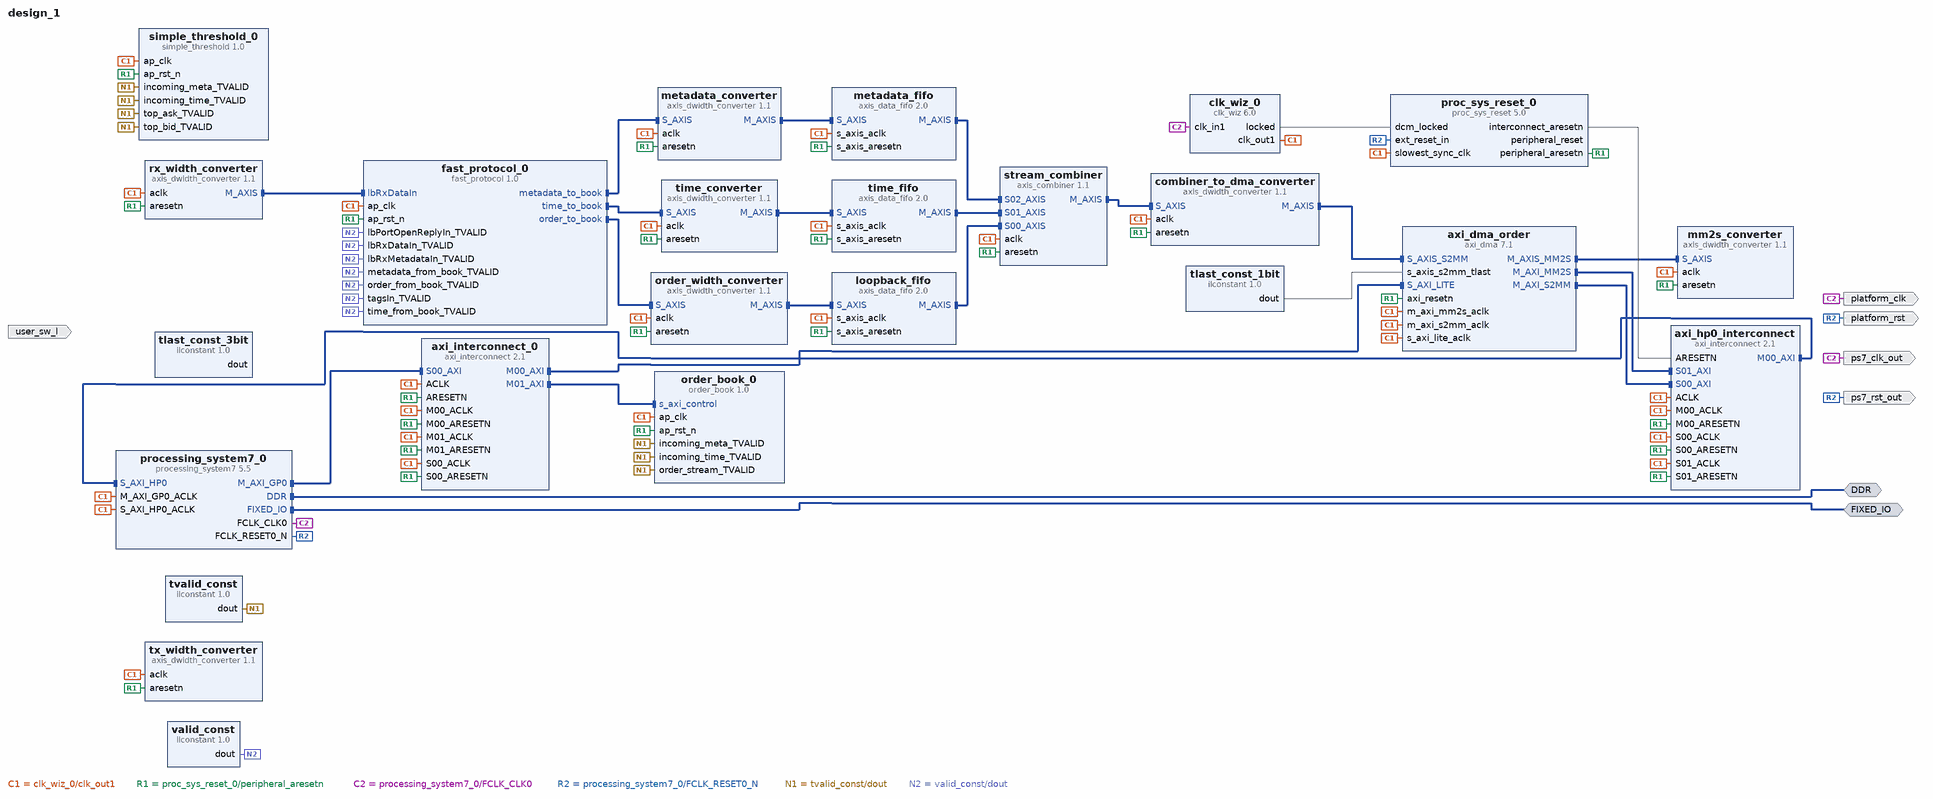
[diagram p0: block diagram of the top level]
# Vivado block design design_1, xc7z020clg400-1, Vivado 2024.2
create_bd_design design_1

create_bd_intf_port -mode Master -vlnv xilinx.com:interface:ddrx_rtl:1.0 DDR
create_bd_intf_port -mode Master -vlnv xilinx.com:display_processing_system7:fixedio_rtl:1.0 FIXED_IO
create_bd_port -dir I user_sw_l
create_bd_port -dir O -type clk ps7_clk_out
set_property -dict {CONFIG.FREQ_HZ 100000000} [get_bd_ports ps7_clk_out]
create_bd_port -dir O -type rst ps7_rst_out
set_property -dict {CONFIG.POLARITY ACTIVE_LOW} [get_bd_ports ps7_rst_out]
create_bd_port -dir O -type clk platform_clk
set_property -dict {CONFIG.ASSOCIATED_RESET platform_rst CONFIG.FREQ_HZ 100000000} [get_bd_ports platform_clk]
create_bd_port -dir O -type rst platform_rst
set_property -dict {CONFIG.POLARITY ACTIVE_LOW} [get_bd_ports platform_rst]

create_bd_cell -type ip -vlnv xilinx.com:ip:processing_system7:5.5 processing_system7_0
set_property -dict [list \
  CONFIG.PCW_APU_PERIPHERAL_FREQMHZ 666.666666 \
  CONFIG.PCW_CRYSTAL_PERIPHERAL_FREQMHZ 50 \
  CONFIG.PCW_ENET0_ENET0_IO {MIO 16 .. 27} \
  CONFIG.PCW_ENET0_GRP_MDIO_ENABLE 1 \
  CONFIG.PCW_ENET0_GRP_MDIO_IO {MIO 52 .. 53} \
  CONFIG.PCW_ENET0_PERIPHERAL_ENABLE 1 \
  CONFIG.PCW_ENET_RESET_ENABLE 0 \
  CONFIG.PCW_FPGA0_PERIPHERAL_FREQMHZ 100.000000 \
  CONFIG.PCW_FPGA1_PERIPHERAL_FREQMHZ 150.000000 \
  CONFIG.PCW_FPGA3_PERIPHERAL_FREQMHZ 100.000000 \
  CONFIG.PCW_GPIO_MIO_GPIO_ENABLE 1 \
  CONFIG.PCW_GPIO_MIO_GPIO_IO MIO \
  CONFIG.PCW_I2C_RESET_ENABLE 1 \
  CONFIG.PCW_M_AXI_GP0_FREQMHZ 10 \
  CONFIG.PCW_PERIPHERAL_BOARD_PRESET part0 \
  CONFIG.PCW_PRESET_BANK0_VOLTAGE LVCMOS33 \
  CONFIG.PCW_PRESET_BANK1_VOLTAGE LVCMOS18 \
  CONFIG.PCW_QSPI_GRP_FBCLK_ENABLE 1 \
  CONFIG.PCW_QSPI_GRP_FBCLK_IO {MIO 8} \
  CONFIG.PCW_QSPI_GRP_SINGLE_SS_ENABLE 1 \
  CONFIG.PCW_QSPI_GRP_SINGLE_SS_IO {MIO 1 .. 6} \
  CONFIG.PCW_QSPI_PERIPHERAL_ENABLE 1 \
  CONFIG.PCW_QSPI_QSPI_IO {MIO 1 .. 6} \
  CONFIG.PCW_SD0_GRP_CD_ENABLE 1 \
  CONFIG.PCW_SD0_GRP_CD_IO {MIO 47} \
  CONFIG.PCW_SD0_GRP_WP_ENABLE 0 \
  CONFIG.PCW_SD0_PERIPHERAL_ENABLE 1 \
  CONFIG.PCW_SD0_SD0_IO {MIO 40 .. 45} \
  CONFIG.PCW_SDIO_PERIPHERAL_FREQMHZ 50 \
  CONFIG.PCW_SINGLE_QSPI_DATA_MODE x4 \
  CONFIG.PCW_UART0_PERIPHERAL_ENABLE 1 \
  CONFIG.PCW_UART0_UART0_IO {MIO 14 .. 15} \
  CONFIG.PCW_UART1_PERIPHERAL_ENABLE 0 \
  CONFIG.PCW_UART_PERIPHERAL_FREQMHZ 100 \
  CONFIG.PCW_UIPARAM_DDR_BUS_WIDTH {16 Bit} \
  CONFIG.PCW_UIPARAM_DDR_FREQ_MHZ 525 \
  CONFIG.PCW_UIPARAM_DDR_PARTNO {MT41J256M16 RE-125} \
  CONFIG.PCW_USB0_PERIPHERAL_ENABLE 1 \
  CONFIG.PCW_USB0_RESET_ENABLE 1 \
  CONFIG.PCW_USB0_RESET_IO {MIO 46} \
  CONFIG.PCW_USB0_USB0_IO {MIO 28 .. 39} \
  CONFIG.PCW_USB_RESET_ENABLE 1 \
  CONFIG.PCW_USB_RESET_SELECT {Share reset pin} \
  CONFIG.PCW_USE_S_AXI_HP0 1 \
  CONFIG.preset None \
] [get_bd_cells processing_system7_0]
# 496 more settings of processing_system7_0 are not shown: defaults, MIO pin electricals, DDR timing, and values the tool derives
create_bd_cell -type ip -vlnv xilinx.com:ip:clk_wiz:6.0 clk_wiz_0
set_property -dict [list \
  CONFIG.CLKOUT1_REQUESTED_OUT_FREQ 100.000 \
  CONFIG.PRIM_IN_FREQ 100.000 \
  CONFIG.USE_LOCKED true \
  CONFIG.USE_RESET false \
  CONFIG.USE_SAFE_CLOCK_STARTUP true \
] [get_bd_cells clk_wiz_0]
create_bd_cell -type ip -vlnv xilinx.com:ip:proc_sys_reset:5.0 proc_sys_reset_0
create_bd_cell -type ip -vlnv xilinx.com:ip:axi_interconnect:2.1 axi_hp0_interconnect
set_property -dict [list \
  CONFIG.M00_HAS_REGSLICE 0 \
  CONFIG.NUM_MI 1 \
  CONFIG.NUM_SI 2 \
  CONFIG.S00_HAS_REGSLICE 0 \
  CONFIG.S01_HAS_REGSLICE 0 \
  CONFIG.S02_HAS_REGSLICE 0 \
  CONFIG.S03_HAS_REGSLICE 0 \
  CONFIG.STRATEGY 1 \
] [get_bd_cells axi_hp0_interconnect]
create_bd_cell -type ip -vlnv xilinx.com:ip:axis_dwidth_converter:1.1 mm2s_converter
set_property -dict [list \
  CONFIG.HAS_TKEEP 1 \
  CONFIG.HAS_TLAST 1 \
  CONFIG.HAS_TSTRB 0 \
  CONFIG.M_TDATA_NUM_BYTES 8 \
  CONFIG.S_TDATA_NUM_BYTES 8 \
] [get_bd_cells mm2s_converter]
create_bd_cell -type ip -vlnv xilinx.com:ip:axis_data_fifo:2.0 loopback_fifo
set_property -dict [list \
  CONFIG.FIFO_DEPTH 32 \
  CONFIG.FIFO_MEMORY_TYPE distributed \
  CONFIG.FIFO_MODE 1 \
  CONFIG.HAS_TKEEP 1 \
  CONFIG.HAS_TLAST 1 \
  CONFIG.HAS_TSTRB 0 \
  CONFIG.TDATA_NUM_BYTES 8 \
  CONFIG.TUSER_WIDTH 0 \
] [get_bd_cells loopback_fifo]
create_bd_cell -type ip -vlnv xilinx.com:ip:axi_dma:7.1 axi_dma_order
set_property -dict [list \
  CONFIG.c_addr_width 32 \
  CONFIG.c_include_mm2s 1 \
  CONFIG.c_include_sg 0 \
  CONFIG.c_m_axis_mm2s_tdata_width 64 \
  CONFIG.c_micro_dma 1 \
  CONFIG.c_mm2s_burst_size 16 \
  CONFIG.c_s2mm_burst_size 16 \
  CONFIG.c_s_axis_s2mm_tdata_width 64 \
  CONFIG.c_sg_length_width 8 \
] [get_bd_cells axi_dma_order]
create_bd_cell -type ip -vlnv xilinx.com:hls:fast_protocol:1.0 fast_protocol_0
create_bd_cell -type ip -vlnv xilinx.com:ip:axis_dwidth_converter:1.1 rx_width_converter
set_property -dict [list \
  CONFIG.HAS_TKEEP 1 \
  CONFIG.HAS_TLAST 1 \
  CONFIG.HAS_TSTRB 0 \
  CONFIG.M_TDATA_NUM_BYTES 16 \
  CONFIG.S_TDATA_NUM_BYTES 8 \
] [get_bd_cells rx_width_converter]
create_bd_cell -type ip -vlnv xilinx.com:ip:axis_dwidth_converter:1.1 tx_width_converter
set_property -dict [list \
  CONFIG.HAS_TKEEP 1 \
  CONFIG.HAS_TLAST 1 \
  CONFIG.HAS_TSTRB 0 \
  CONFIG.M_TDATA_NUM_BYTES 8 \
  CONFIG.S_TDATA_NUM_BYTES 16 \
] [get_bd_cells tx_width_converter]
create_bd_cell -type ip -vlnv xilinx.com:ip:axis_dwidth_converter:1.1 order_width_converter
set_property -dict [list \
  CONFIG.HAS_TKEEP 1 \
  CONFIG.HAS_TLAST 1 \
  CONFIG.HAS_TSTRB 0 \
  CONFIG.M_TDATA_NUM_BYTES 8 \
  CONFIG.S_TDATA_NUM_BYTES 8 \
] [get_bd_cells order_width_converter]
create_bd_cell -type ip -vlnv xilinx.com:ip:axis_dwidth_converter:1.1 time_converter
set_property -dict [list \
  CONFIG.HAS_TKEEP 1 \
  CONFIG.HAS_TLAST 1 \
  CONFIG.HAS_TSTRB 0 \
  CONFIG.M_TDATA_NUM_BYTES 8 \
  CONFIG.S_TDATA_NUM_BYTES 8 \
] [get_bd_cells time_converter]
create_bd_cell -type ip -vlnv xilinx.com:ip:axis_data_fifo:2.0 time_fifo
set_property -dict [list \
  CONFIG.FIFO_DEPTH 32 \
  CONFIG.FIFO_MEMORY_TYPE auto \
  CONFIG.HAS_TKEEP 1 \
  CONFIG.HAS_TLAST 1 \
  CONFIG.HAS_TSTRB 0 \
  CONFIG.TDATA_NUM_BYTES 8 \
] [get_bd_cells time_fifo]
create_bd_cell -type ip -vlnv xilinx.com:ip:axis_dwidth_converter:1.1 metadata_converter
set_property -dict [list \
  CONFIG.HAS_TKEEP 1 \
  CONFIG.HAS_TLAST 1 \
  CONFIG.HAS_TSTRB 0 \
  CONFIG.M_TDATA_NUM_BYTES 8 \
  CONFIG.S_TDATA_NUM_BYTES 16 \
] [get_bd_cells metadata_converter]
create_bd_cell -type ip -vlnv xilinx.com:ip:axis_data_fifo:2.0 metadata_fifo
set_property -dict [list \
  CONFIG.FIFO_DEPTH 32 \
  CONFIG.FIFO_MEMORY_TYPE auto \
  CONFIG.HAS_TKEEP 1 \
  CONFIG.HAS_TLAST 1 \
  CONFIG.HAS_TSTRB 0 \
  CONFIG.TDATA_NUM_BYTES 8 \
] [get_bd_cells metadata_fifo]
create_bd_cell -type inline_hdl -vlnv xilinx.com:inline_hdl:ilconstant:1.0 valid_const
set_property -dict {CONFIG.CONST_VAL 1} [get_bd_cells valid_const]
create_bd_cell -type ip -vlnv xilinx.com:ip:axi_interconnect:2.1 axi_interconnect_0
set_property -dict {CONFIG.NUM_MI 2 CONFIG.NUM_SI 1 CONFIG.STRATEGY 1} [get_bd_cells axi_interconnect_0]
create_bd_cell -type ip -vlnv xilinx.com:hls:order_book:1.0 order_book_0
create_bd_cell -type ip -vlnv xilinx.com:hls:simple_threshold:1.0 simple_threshold_0
create_bd_cell -type inline_hdl -vlnv xilinx.com:inline_hdl:ilconstant:1.0 tlast_const_3bit
set_property -dict {CONFIG.CONST_VAL 7 CONFIG.CONST_WIDTH 3} [get_bd_cells tlast_const_3bit]
create_bd_cell -type inline_hdl -vlnv xilinx.com:inline_hdl:ilconstant:1.0 tlast_const_1bit
set_property -dict {CONFIG.CONST_VAL 1 CONFIG.CONST_WIDTH 1} [get_bd_cells tlast_const_1bit]
create_bd_cell -type inline_hdl -vlnv xilinx.com:inline_hdl:ilconstant:1.0 tvalid_const
set_property -dict {CONFIG.CONST_VAL 1 CONFIG.CONST_WIDTH 1} [get_bd_cells tvalid_const]
create_bd_cell -type ip -vlnv xilinx.com:ip:axis_combiner:1.1 stream_combiner
set_property -dict [list \
  CONFIG.HAS_TKEEP 1 \
  CONFIG.HAS_TLAST 1 \
  CONFIG.HAS_TSTRB 0 \
  CONFIG.NUM_SI 3 \
  CONFIG.TDATA_NUM_BYTES 8 \
] [get_bd_cells stream_combiner]
create_bd_cell -type ip -vlnv xilinx.com:ip:axis_dwidth_converter:1.1 combiner_to_dma_converter
set_property -dict [list \
  CONFIG.HAS_TKEEP 1 \
  CONFIG.HAS_TLAST 1 \
  CONFIG.HAS_TSTRB 0 \
  CONFIG.M_TDATA_NUM_BYTES 8 \
  CONFIG.S_TDATA_NUM_BYTES 24 \
] [get_bd_cells combiner_to_dma_converter]

# ---- connections ----

connect_bd_intf_net [get_bd_intf_pins axi_dma_order/M_AXIS_MM2S] [get_bd_intf_pins mm2s_converter/S_AXIS]
connect_bd_intf_net [get_bd_intf_pins axi_dma_order/M_AXI_MM2S] [get_bd_intf_pins axi_hp0_interconnect/S01_AXI]
connect_bd_intf_net [get_bd_intf_pins axi_dma_order/M_AXI_S2MM] [get_bd_intf_pins axi_hp0_interconnect/S00_AXI]
connect_bd_intf_net [get_bd_intf_pins axi_hp0_interconnect/M00_AXI] [get_bd_intf_pins processing_system7_0/S_AXI_HP0]
connect_bd_intf_net [get_bd_intf_pins axi_dma_order/S_AXI_LITE] [get_bd_intf_pins axi_interconnect_0/M00_AXI]
connect_bd_intf_net [get_bd_intf_pins axi_interconnect_0/M01_AXI] [get_bd_intf_pins order_book_0/s_axi_control]
connect_bd_intf_net [get_bd_intf_pins fast_protocol_0/metadata_to_book] [get_bd_intf_pins metadata_converter/S_AXIS]
connect_bd_intf_net [get_bd_intf_pins fast_protocol_0/order_to_book] [get_bd_intf_pins order_width_converter/S_AXIS]
connect_bd_intf_net [get_bd_intf_pins fast_protocol_0/time_to_book] [get_bd_intf_pins time_converter/S_AXIS]
connect_bd_intf_net [get_bd_intf_pins loopback_fifo/M_AXIS] [get_bd_intf_pins stream_combiner/S00_AXIS]
connect_bd_intf_net [get_bd_intf_pins metadata_converter/M_AXIS] [get_bd_intf_pins metadata_fifo/S_AXIS]
connect_bd_intf_net [get_bd_intf_pins metadata_fifo/M_AXIS] [get_bd_intf_pins stream_combiner/S02_AXIS]
connect_bd_intf_net [get_bd_intf_pins order_width_converter/M_AXIS] [get_bd_intf_pins loopback_fifo/S_AXIS]
connect_bd_intf_net [get_bd_intf_ports DDR] [get_bd_intf_pins processing_system7_0/DDR]
connect_bd_intf_net [get_bd_intf_ports FIXED_IO] [get_bd_intf_pins processing_system7_0/FIXED_IO]
connect_bd_intf_net [get_bd_intf_pins processing_system7_0/M_AXI_GP0] [get_bd_intf_pins axi_interconnect_0/S00_AXI]
connect_bd_intf_net [get_bd_intf_pins rx_width_converter/M_AXIS] [get_bd_intf_pins fast_protocol_0/lbRxDataIn]
connect_bd_intf_net [get_bd_intf_pins stream_combiner/M_AXIS] [get_bd_intf_pins combiner_to_dma_converter/S_AXIS]
connect_bd_intf_net -intf_net stream_switch_M00_AXIS [get_bd_intf_pins combiner_to_dma_converter/M_AXIS] [get_bd_intf_pins axi_dma_order/S_AXIS_S2MM]
connect_bd_intf_net [get_bd_intf_pins time_converter/M_AXIS] [get_bd_intf_pins time_fifo/S_AXIS]
connect_bd_intf_net [get_bd_intf_pins time_fifo/M_AXIS] [get_bd_intf_pins stream_combiner/S01_AXIS]
connect_bd_net [get_bd_pins clk_wiz_0/clk_out1] \
  [get_bd_pins proc_sys_reset_0/slowest_sync_clk] [get_bd_pins processing_system7_0/M_AXI_GP0_ACLK] \
  [get_bd_pins mm2s_converter/aclk] [get_bd_pins loopback_fifo/s_axis_aclk] [get_bd_pins axi_dma_order/s_axi_lite_aclk] \
  [get_bd_pins axi_dma_order/m_axi_s2mm_aclk] [get_bd_pins axi_dma_order/m_axi_mm2s_aclk] \
  [get_bd_pins axi_hp0_interconnect/ACLK] [get_bd_pins axi_hp0_interconnect/S00_ACLK] \
  [get_bd_pins axi_hp0_interconnect/S01_ACLK] [get_bd_pins axi_hp0_interconnect/M00_ACLK] \
  [get_bd_pins processing_system7_0/S_AXI_HP0_ACLK] [get_bd_pins fast_protocol_0/ap_clk] \
  [get_bd_pins rx_width_converter/aclk] [get_bd_pins tx_width_converter/aclk] [get_bd_pins order_width_converter/aclk] \
  [get_bd_pins time_converter/aclk] [get_bd_pins time_fifo/s_axis_aclk] [get_bd_pins metadata_converter/aclk] \
  [get_bd_pins metadata_fifo/s_axis_aclk] [get_bd_pins axi_interconnect_0/ACLK] [get_bd_pins axi_interconnect_0/S00_ACLK] \
  [get_bd_pins axi_interconnect_0/M00_ACLK] [get_bd_pins axi_interconnect_0/M01_ACLK] [get_bd_pins order_book_0/ap_clk] \
  [get_bd_pins simple_threshold_0/ap_clk] [get_bd_pins stream_combiner/aclk] [get_bd_pins combiner_to_dma_converter/aclk]
connect_bd_net [get_bd_pins clk_wiz_0/locked] [get_bd_pins proc_sys_reset_0/dcm_locked]
connect_bd_net [get_bd_pins proc_sys_reset_0/interconnect_aresetn] [get_bd_pins axi_hp0_interconnect/ARESETN]
connect_bd_net [get_bd_pins proc_sys_reset_0/peripheral_aresetn] \
  [get_bd_pins mm2s_converter/aresetn] [get_bd_pins loopback_fifo/s_axis_aresetn] [get_bd_pins axi_dma_order/axi_resetn] \
  [get_bd_pins axi_hp0_interconnect/S00_ARESETN] [get_bd_pins axi_hp0_interconnect/S01_ARESETN] \
  [get_bd_pins axi_hp0_interconnect/M00_ARESETN] [get_bd_pins fast_protocol_0/ap_rst_n] \
  [get_bd_pins rx_width_converter/aresetn] [get_bd_pins tx_width_converter/aresetn] \
  [get_bd_pins order_width_converter/aresetn] [get_bd_pins time_converter/aresetn] [get_bd_pins time_fifo/s_axis_aresetn] \
  [get_bd_pins metadata_converter/aresetn] [get_bd_pins metadata_fifo/s_axis_aresetn] \
  [get_bd_pins axi_interconnect_0/ARESETN] [get_bd_pins axi_interconnect_0/S00_ARESETN] \
  [get_bd_pins axi_interconnect_0/M00_ARESETN] [get_bd_pins axi_interconnect_0/M01_ARESETN] \
  [get_bd_pins order_book_0/ap_rst_n] [get_bd_pins simple_threshold_0/ap_rst_n] [get_bd_pins stream_combiner/aresetn] \
  [get_bd_pins combiner_to_dma_converter/aresetn]
# net proc_sys_reset_0_peripheral_reset has one end: proc_sys_reset_0/peripheral_reset
connect_bd_net [get_bd_pins processing_system7_0/FCLK_CLK0] [get_bd_pins clk_wiz_0/clk_in1] [get_bd_ports ps7_clk_out] [get_bd_ports platform_clk]
connect_bd_net [get_bd_pins processing_system7_0/FCLK_RESET0_N] \
  [get_bd_pins proc_sys_reset_0/ext_reset_in] [get_bd_ports ps7_rst_out] [get_bd_ports platform_rst]
connect_bd_net [get_bd_pins tlast_const_1bit/dout] [get_bd_pins axi_dma_order/s_axis_s2mm_tlast]
# net tlast_const_3bit_dout has one end: tlast_const_3bit/dout
connect_bd_net [get_bd_pins tvalid_const/dout] \
  [get_bd_pins order_book_0/incoming_meta_TVALID] [get_bd_pins order_book_0/incoming_time_TVALID] \
  [get_bd_pins order_book_0/order_stream_TVALID] [get_bd_pins simple_threshold_0/incoming_meta_TVALID] \
  [get_bd_pins simple_threshold_0/incoming_time_TVALID] [get_bd_pins simple_threshold_0/top_ask_TVALID] \
  [get_bd_pins simple_threshold_0/top_bid_TVALID]
# net user_sw_l_1 has one end: user_sw_l
connect_bd_net [get_bd_pins valid_const/dout] \
  [get_bd_pins fast_protocol_0/lbPortOpenReplyIn_TVALID] [get_bd_pins fast_protocol_0/lbRxDataIn_TVALID] \
  [get_bd_pins fast_protocol_0/lbRxMetadataIn_TVALID] [get_bd_pins fast_protocol_0/metadata_from_book_TVALID] \
  [get_bd_pins fast_protocol_0/order_from_book_TVALID] [get_bd_pins fast_protocol_0/tagsIn_TVALID] \
  [get_bd_pins fast_protocol_0/time_from_book_TVALID]

# ---- address map ----
assign_bd_address -offset 0x00000000 -range 512M -target_address_space [get_bd_addr_spaces axi_dma_order/Data_MM2S] [get_bd_addr_segs processing_system7_0/S_AXI_HP0/HP0_DDR_LOWOCM]
assign_bd_address -offset 0x00000000 -range 512M -target_address_space [get_bd_addr_spaces axi_dma_order/Data_S2MM] [get_bd_addr_segs processing_system7_0/S_AXI_HP0/HP0_DDR_LOWOCM]
assign_bd_address -offset 0x40000000 -range 64K -target_address_space [get_bd_addr_spaces processing_system7_0/Data] [get_bd_addr_segs order_book_0/s_axi_control/Reg]
assign_bd_address -offset 0x41E00000 -range 64K -target_address_space [get_bd_addr_spaces processing_system7_0/Data] [get_bd_addr_segs axi_dma_order/S_AXI_LITE/Reg]

validate_bd_design
save_bd_design
